# EAGLE design BrazoRobotico (EAGLE 9.1.0)
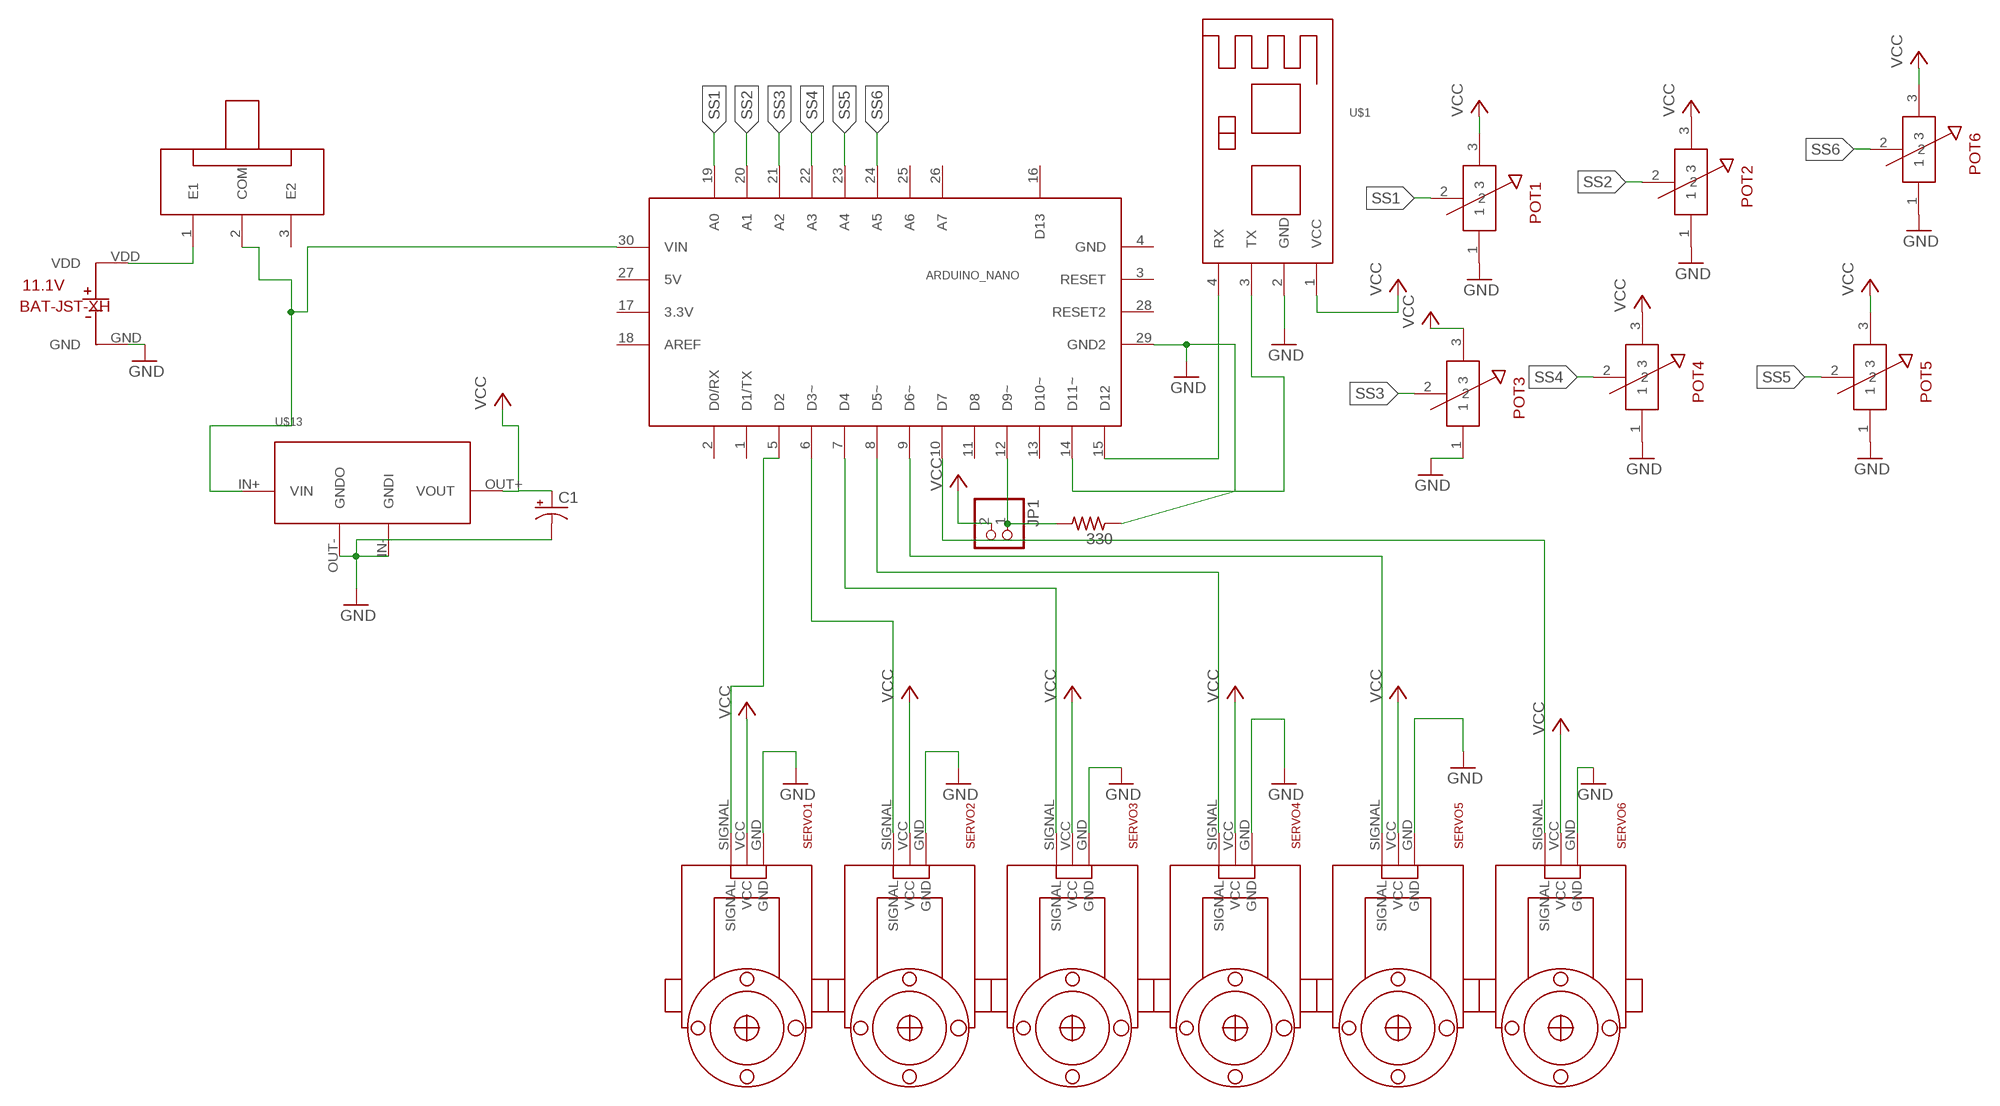
[diagram p0: schematic, sheet 1]

## Parts
11.1V  BAT-JST-XH  [JST-XH-2]
330  R-US_0207/7  [0207/7]
ARDUINO_NANO  NANO  [NANO]
C1  CPOL-USE5-10.5  [E5-10,5]
JP1  PINHD-1X2  [1X02]
POT1  POTENCIOMETRO_GDE  [POTENCIOMETRO_GENERICO]
POT2  POTENCIOMETRO_GDE  [POTENCIOMETRO_GENERICO]
POT3  POTENCIOMETRO_GDE  [POTENCIOMETRO_GENERICO]
POT4  POTENCIOMETRO_GDE  [POTENCIOMETRO_GENERICO]
POT5  POTENCIOMETRO_GDE  [POTENCIOMETRO_GENERICO]
POT6  POTENCIOMETRO_GDE  [POTENCIOMETRO_GENERICO]
SERVO1  SERVOMOTORES  [SERVO]
SERVO2  SERVOMOTORES  [SERVO]
SERVO3  SERVOMOTORES  [SERVO]
SERVO4  SERVOMOTORES  [SERVO]
SERVO5  SERVOMOTORES  [SERVO]
SERVO6  SERVOMOTORES  [SERVO]
U$1  HC-06  [HC-06]
U$13  STEPDOWN  [STEPDOWN]
U$14  TRIPLEPOLO  [TRIPLEPOLO]

## Nets
GND: 11.1V.GND 330.1 ARDUINO_NANO.29(GND2) C1.- POT1.1 POT2.1 POT3.1 POT4.1 POT5.1 POT6.1 SERVO1.GND SERVO2.GND SERVO3.GND SERVO4.GND SERVO5.GND SERVO6.GND U$1.2(GND) U$13.IN-(GNDI) U$13.OUT-(GNDO)
N$1: ARDUINO_NANO.8(D5~) SERVO4.SIGNAL
N$2: ARDUINO_NANO.9(D6~) SERVO5.SIGNAL
N$3: ARDUINO_NANO.5(D2) SERVO1.SIGNAL
N$4: ARDUINO_NANO.6(D3~) SERVO2.SIGNAL
N$5: ARDUINO_NANO.7(D4) SERVO3.SIGNAL
N$6: ARDUINO_NANO.30(VIN) U$13.IN+(VIN) U$14.2(COM)
N$7: ARDUINO_NANO.10(D7) SERVO6.SIGNAL
N$8: ARDUINO_NANO.15(D12) U$1.4(RX)
N$9: ARDUINO_NANO.14(D11~) U$1.3(TX)
N$11: 330.2 ARDUINO_NANO.12(D9~) JP1.1
N$13: 11.1V.VDD U$14.1(E1)
SS1: ARDUINO_NANO.19(A0) POT1.2
SS2: ARDUINO_NANO.20(A1) POT2.2
SS3: ARDUINO_NANO.21(A2) POT3.2
SS4: ARDUINO_NANO.22(A3) POT4.2
SS5: ARDUINO_NANO.23(A4) POT5.2
SS6: ARDUINO_NANO.24(A5) POT6.2
VCC: C1.+ JP1.2 POT1.3 POT2.3 POT3.3 POT4.3 POT5.3 POT6.3 SERVO1.VCC SERVO2.VCC SERVO3.VCC SERVO4.VCC SERVO5.VCC SERVO6.VCC U$1.1(VCC) U$13.OUT+(VOUT)
Unconnected: ARDUINO_NANO.1(D1/TX) ARDUINO_NANO.2(D0/RX) ARDUINO_NANO.3(RESET) ARDUINO_NANO.4(GND) ARDUINO_NANO.11(D8) ARDUINO_NANO.13(D10~) ARDUINO_NANO.16(D13) ARDUINO_NANO.17(3.3V) ARDUINO_NANO.18(AREF) ARDUINO_NANO.25(A6) ARDUINO_NANO.26(A7) ARDUINO_NANO.27(5V) ARDUINO_NANO.28(RESET2) U$14.3(E2)

## Library data of the parts
11.1V = CONECTORES:BAT-JST-XH: Bateria con bornes headers jst-xh
330 = rcl:R-US_: RESISTOR, American symbol; SPICEPREFIX: R
ARDUINO_NANO = arduino:NANO
C1 = rcl:CPOL-US: POLARIZED CAPACITOR, American symbol; SPICEPREFIX: C
JP1 = pinhead:PINHD-1X2: PIN HEADER
POT1-POT6 = POTENCIOMETROS:POTENCIOMETRO_GDE: potenciometro tamaño general
SERVO1-SERVO6 = motores:SERVOMOTORES: Servomotor normal
U$1 = hc-06:HC-06
U$13 = fuenteconmutada:STEPDOWN: Fuente conmutada tipo stepdown Vin [4.5 a 28V] Vot [0.8 a 20V] Corriente Maxima: 3A Eficiencia de Conversion maxima = 96% frecuencia de conmutacion 15MHz maxima, 1MHz tipica
U$14 = interruptores:TRIPLEPOLO: TRIPLE POLO DOBLE TIRO, INTERRUPTOR CHIDORI MAMALON PARA APAGAR TU ROBOT Y NO SE LE GASTE LA PILA, O NO ANDE ANDANDO POR AHI EL CABRON

## Board
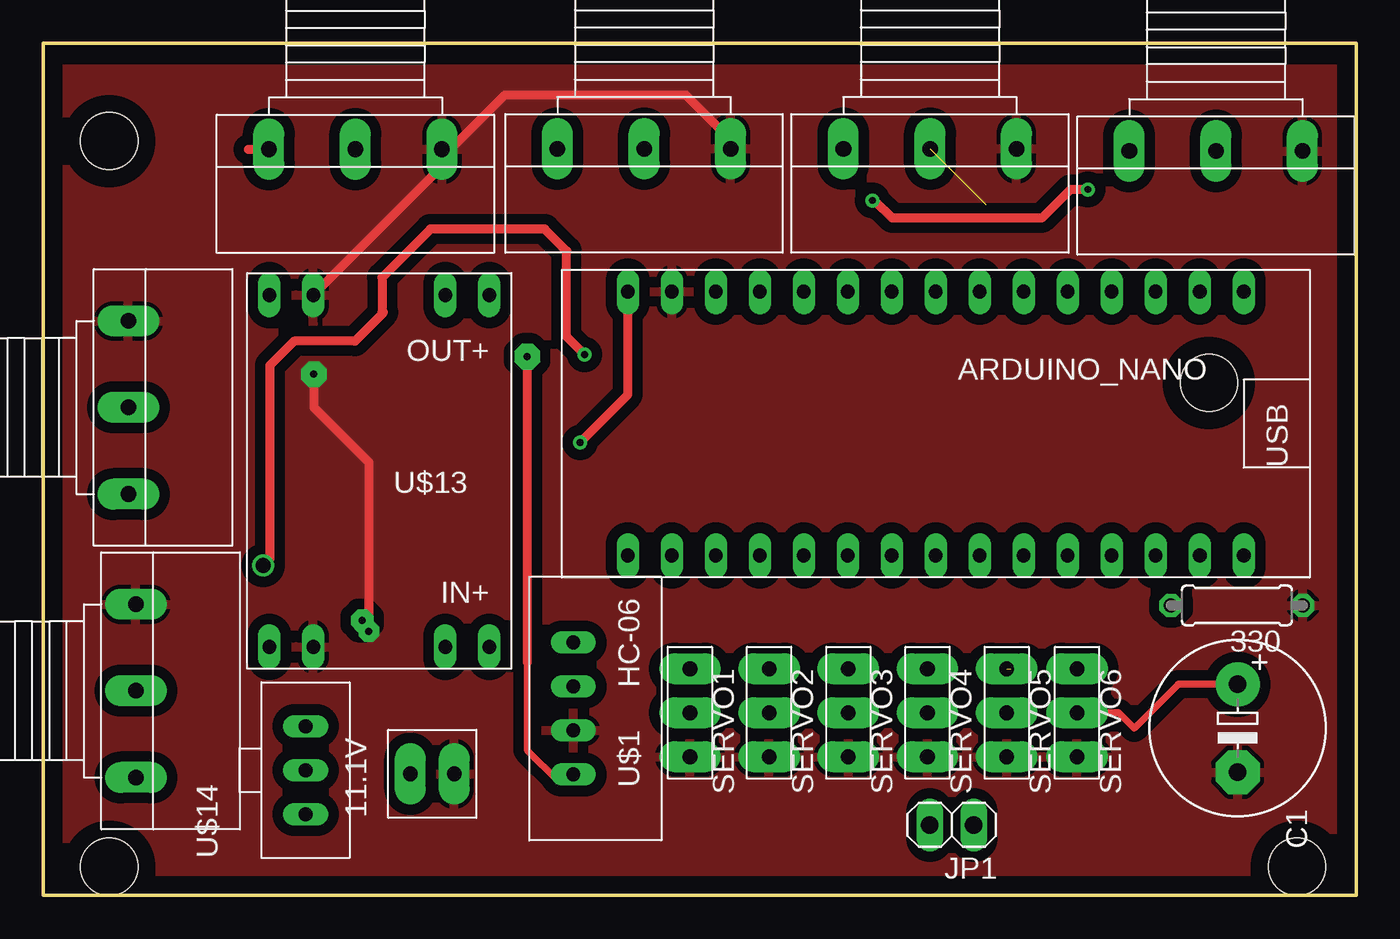
[diagram p1: board, top side]
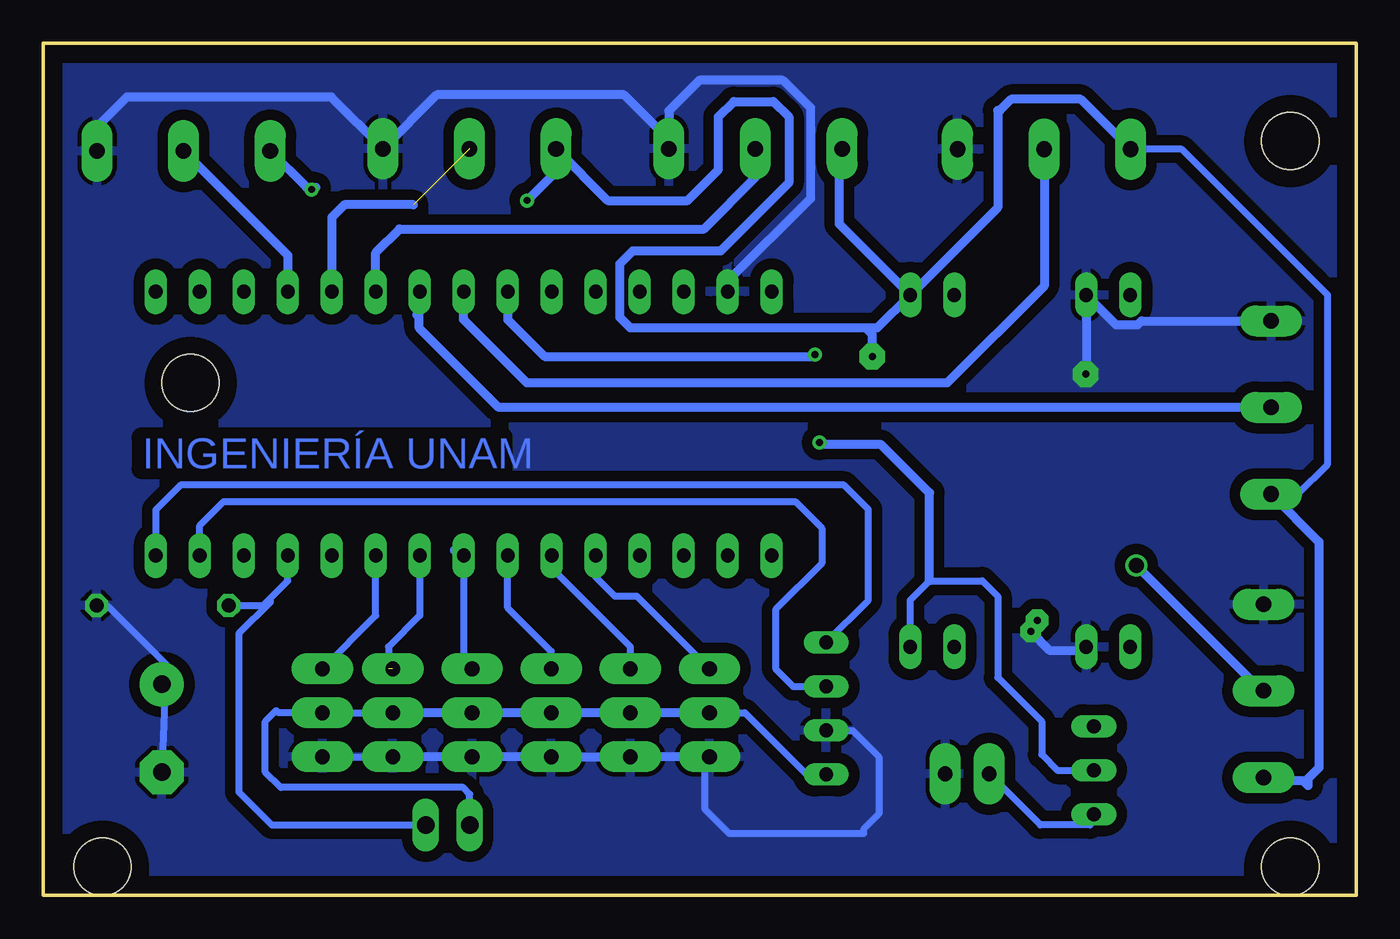
[diagram p2: board, bottom side, seen from below]

Size 75.81 x 49.21 mm. Coordinates in mm from the lower left corner, seen from the top.
Outline: 0,0 75.81,0 75.81,49.21 0,49.21 0,0
Copper layers (1*16): Top 0.035mm / dielectric 1.5mm / Bottom 0.035mm
Design rules "default": minimum track width 6mil, minimum drill 0.35mm, track to track 6mil, track to pad 6mil, pad to pad 6mil, via to via 6mil, smd to smd 6mil, copper to edge 40mil, drill to drill 6mil, minimum pad ring 10mil, minimum via ring 8mil, stop-mask expansion 4mil, vias tented up to drill 0mil, thermal gap 10mil
Holes 3.29 mm at 3.81,1.65 3.81,43.56 72.39,1.65 67.31,29.59

### Footprints (pad centres in the part's own frame; a part is rotated, then mirrored left to right if it is on the bottom)
JST-XH-2 = drill 0.85 pad 1.778 long: GND 0,0; VDD -2.54,0
0207/7 = drill 0.813 octagon: 1 -3.81,0; 2 3.81,0
NANO = drill 0.8 long: 1 -7.62,-8.89; 2 -5.08,-8.89; 3 -2.54,-8.89; 4 0,-8.89; 5 2.54,-8.89; 6 5.08,-8.89; 7 7.62,-8.89; 8 10.16,-8.89; 9 12.7,-8.89; 10 15.24,-8.89; 11 17.78,-8.89; 12 20.32,-8.89; 13 22.86,-8.89; 14 25.4,-8.89; 15 27.94,-8.89; 16 27.94,6.35; 17 25.4,6.35; 18 22.86,6.35; 19 20.32,6.35; 20 17.78,6.35; 21 15.24,6.35; 22 12.7,6.35; 23 10.16,6.35; 24 7.62,6.35; 25 5.08,6.35; 26 2.54,6.35; 27 0,6.35; 28 -2.54,6.35; 29 -5.08,6.35; 30 -7.62,6.35
E5-10,5 = drill 1.016 pad 2.54: + -2.54,0 | drill 1.016 pad 2.54 octagon: - 2.54,0
1X02 = drill 1.016 long: 1 -1.27,0; 2 1.27,0
POTENCIOMETRO_GENERICO = drill 0.9 pad 1.778 long: 1 5,1; 2 0,1; 3 -5,1
SERVO = drill 0.85 pad 1.778 long: GND 3.81,0; SIGNAL -1.27,0; VCC 1.27,0
HC-06 = drill 0.8 long: 1 -1.27,5.08; 2 -3.81,5.08; 3 -6.35,5.08; 4 -8.89,5.08
STEPDOWN = drill 0.8 long: IN2+ -5.08,7.62; IN2- 5.08,7.62; IN+ -7.62,7.62; IN- 2.54,7.62; OUT2+ -5.08,-12.7; OUT2- 5.08,-12.7; OUT+ -7.62,-12.7; OUT- 2.54,-12.7
TRIPLEPOLO = drill 0.8 long: 1 -2.54,0; 2 0,0; 3 2.54,0

### Placement (x,y rotation side)
11.1V  23.73,7.02 0 top
330  68.92,16.74 180 top
ARDUINO_NANO  41.37,28.51 0 top
C1  68.96,9.65 270 top
JP1  52.45,4.06 180 top
POT1  67.71,41.99 0 top
POT2  51.2,42.12 0 top
POT3  34.69,42.12 0 top
POT4  5.92,28.18 90 top
POT5  18.02,42.09 0 top
POT6  6.35,11.81 90 top
SERVO1  37.34,11.81 270 top
SERVO2  41.91,11.81 270 top
SERVO3  46.48,11.81 270 top
SERVO4  51.05,11.81 270 top
SERVO5  55.63,11.81 270 top
SERVO6  59.69,11.81 270 top
U$1  25.53,5.71 270 top
U$13  18.13,21.97 180 top
U$14  15.14,7.22 90 top

### Tracks (layer width: path | path; a pad name or v marks a point on that pad's centre or on a via)
GND  (via drill 0.4 pad 1.2, 0.4 pad 1.47)
  Top 0.508: U$13.OUT- 23.02,42.1 POT5.1 23.53,43.09 26.67,46.23 37.08,46.23 39.62,43.69 39.62,43.18 POT3.1 | v15.62,30.1 15.62,28.19 18.8,25.02 18.8,15.62 18.67,15.49 18.67,15.37 v18.8,15.24
  Bottom 0.406: 15.98,13.96 15.8,14.15 U$13.IN- | 330.1 72.11,16.74 68.71,13.33 C1.- | SERVO6.GND SERVO5.GND | U$1.2 29.08,9.53 27.81,8.25 27.56,8 27.56,4.7 28.45,3.81 28.45,3.56 36.2,3.56 37.59,4.95 37.59,7.75 SERVO1.GND
  Bottom 0.508: POT4.1 12.39,33.18 12.61,32.96 13.88,32.96 U$13.OUT- 15.59,30.38 15.62,30.35 v15.62,30.1 | POT1.1 72.71,44.38 70.99,46.1 59.19,46.1 POT2.1 53.09,46.23 42.29,46.23 39.69,43.63 POT3.1 39.69,45.31 37.93,47.07 33.1,47.07 31.5,45.47 31.5,40.26 36.29,35.46 ARDUINO_NANO.29 | 36.45,8 SERVO1.GND SERVO2.GND SERVO3.GND SERVO4.GND SERVO5.GND | v18.8,15.24 17.7,14.15 15.8,14.15
  pour Top (isolate 0.61): 0,47.75 75.95,47.75 75.95,0.13 -0.13,0.13 -0.13,47.75
  pour Bottom (isolate 0.61): 0,47.88 75.69,47.88 75.69,0.13 0,0.13
N$1
  Bottom 0.406: ARDUINO_NANO.8 51.53,13.68 50.93,13.08
  Bottom 0.508: ARDUINO_NANO.8 51.75,19.62 52.07,19.94 | 49.91,13.08 50.93,13.08 SERVO4.SIGNAL
N$2  (1 unrouted)
  Bottom 0.406: ARDUINO_NANO.9 54.07,16.16 55.88,14.35 55.88,13.08
N$3
  Bottom 0.406: SERVO1.SIGNAL 41.53,17.27 42.8,17.27 43.91,18.38 ARDUINO_NANO.5
  Bottom 0.508: 37.37,13.08 SERVO1.SIGNAL
N$4
  Bottom 0.406: SERVO2.SIGNAL 41.91,14.35 46.48,18.92 46.48,19.59 ARDUINO_NANO.6
N$5
  Bottom 0.406: ARDUINO_NANO.7 48.99,16.61 46.48,14.1 SERVO3.SIGNAL
  Bottom 0.508: 45.97,13.08 SERVO3.SIGNAL
N$6  (via drill 0.4)
  Top 0.508: v30.99,26.16 33.75,28.92 ARDUINO_NANO.30
  Bottom 0.406: U$13.IN+ 25.75,17.05 24.64,18.16 21.59,18.16 20.7,17.27 20.7,12.57 18.16,10.03 18.16,8.13 17.26,7.22 U$14.2
  Bottom 0.508: 15.29,7.37 U$14.2 | ARDUINO_NANO.30 33.75,35.21 | 24.64,18.16 24.64,23.24 27.43,26.04 30.86,26.04 v30.99,26.16
N$7
  Bottom 0.406: SERVO6.SIGNAL 56.61,16.16 ARDUINO_NANO.10
N$8
  Bottom 0.406: U$1.4 28.17,17.04 28.17,22.29 29.57,23.69 67.88,23.69 69.31,22.26 ARDUINO_NANO.15
N$9
  Bottom 0.406: ARDUINO_NANO.14 66.77,21.37 65.41,22.73 32.38,22.73 30.86,21.21 30.86,19.18 33.53,16.51 33.53,13.08 32.51,12.06 U$1.3
N$10  (via drill 0.4 pad 1.3)
  other vias: 18.41,15.88
N$11
  Bottom 0.406: ARDUINO_NANO.12 61.69,18.16 62.71,17.14 | 330.2 63.11,16.74 62.71,17.14 | JP1.1 62.61,4.06 64.52,5.97 64.52,15.11 62.71,16.92 62.71,17.14
N$13
  Bottom 0.406: U$14.1 15.37,4.46 15.37,4.06 18.24,4.06 11.1V.VDD
SS1
  Bottom 0.508: POT1.2 61.69,36.97 ARDUINO_NANO.19
SS2  (1 unrouted)
  Bottom 0.508: 54.44,39.88 58.42,39.88 59.15,39.15 ARDUINO_NANO.20
SS3
  Bottom 0.406: 56.39,35.08 ARDUINO_NANO.21
  Bottom 0.508: ARDUINO_NANO.21 56.61,37.12 55.24,38.48 37.67,38.48 34.69,41.46 POT3.2
SS4
  Bottom 0.508: 54.23,33.53 54.07,33.69 ARDUINO_NANO.22 54.1,34.83 54.1,32.77 49.51,28.18 POT4.2
SS5
  Bottom 0.508: POT5.2 18.02,35.2 23.62,29.59 47.88,29.59 51.56,33.27 51.53,33.31 ARDUINO_NANO.23
SS6  (via drill 0.4, 0.85)
  Top 0.508: v31.24,31.24 30.23,32.26 30.23,37.21 28.96,38.48 22.35,38.48 19.56,35.69 19.56,33.66 19.65,33.66 18,32 14.48,32 13.08,30.61 13.08,19.43 v12.7,19.05
  Bottom 0.508: ARDUINO_NANO.24 48.99,33.24 46.86,31.11 31.37,31.11 v31.24,31.24 | v12.7,19.05 5.46,11.81 POT6.2
VCC  (via drill 0.4, 0.4 pad 1.47)
  Top 0.406: 27.94,13.46 27.94,8.38 29.72,6.6 30.1,6.98 U$1.1 | C1.+ 65.53,12.19 62.99,9.65 62.1,10.54 SERVO6.VCC
  Top 0.508: 26.03,34.67 U$13.OUT+ | 11.85,43.09 POT5.3 | 27.94,13.46 27.94,30.99 28.07,31.11 v27.94,31.11 | v60.33,40.77 59.31,40.77 57.66,39.12 49.02,39.12 48.01,40.13 v47.88,40.13
  Bottom 0.406: SERVO5.VCC SERVO6.VCC 62.23,10.54 62.36,10.67 62.99,10.03 62.99,7.11 62.1,6.22 51.56,6.22 51.18,5.84 JP1.2 | SERVO1.VCC 35.31,10.54 31.62,6.86 30.73,6.86 U$1.1 | POT4.3 3.37,23.18 1.65,24.89 1.65,34.67 10.07,43.09 POT5.3
  Bottom 0.508: U$13.OUT+ 29.84,38.77 29.84,42.96 POT3.3 | U$13.OUT+ 27.66,32.77 28.32,32.77 | 28.32,32.77 41.91,32.77 42.51,33.37 42.51,36.48 41.78,37.21 36.7,37.21 32.77,41.15 32.77,44.96 33.66,45.85 35.94,45.85 36.83,44.96 36.83,41.91 38.61,40.13 43.22,40.13 46.12,43.03 | POT5.3 15.9,45.97 19.94,45.97 20.57,45.34 20.7,45.34 20.7,39.73 U$13.OUT+ | SERVO5.VCC SERVO4.VCC 51.05,9.91 50.42,10.54 SERVO3.VCC SERVO2.VCC SERVO1.VCC 36.2,10.54 | POT2.3 46.12,43.03 | v27.94,31.11 27.94,32.38 28.32,32.77 | POT4.3 2.16,20.42 2.16,7.37 2.79,6.73 2.79,6.35 3.05,6.6 5.14,6.6 POT6.3 | POT1.3 60.62,40.89 60.07,40.89 60.2,40.77 v60.33,40.77 | v47.88,40.13 46.12,41.89 46.12,43.03

### Text on the board
Bottom: INGENIERÍA UNAM